# EAGLE design frankfurt_eth_pic (EAGLE 6.6.0)

## Sheet 1 of 3
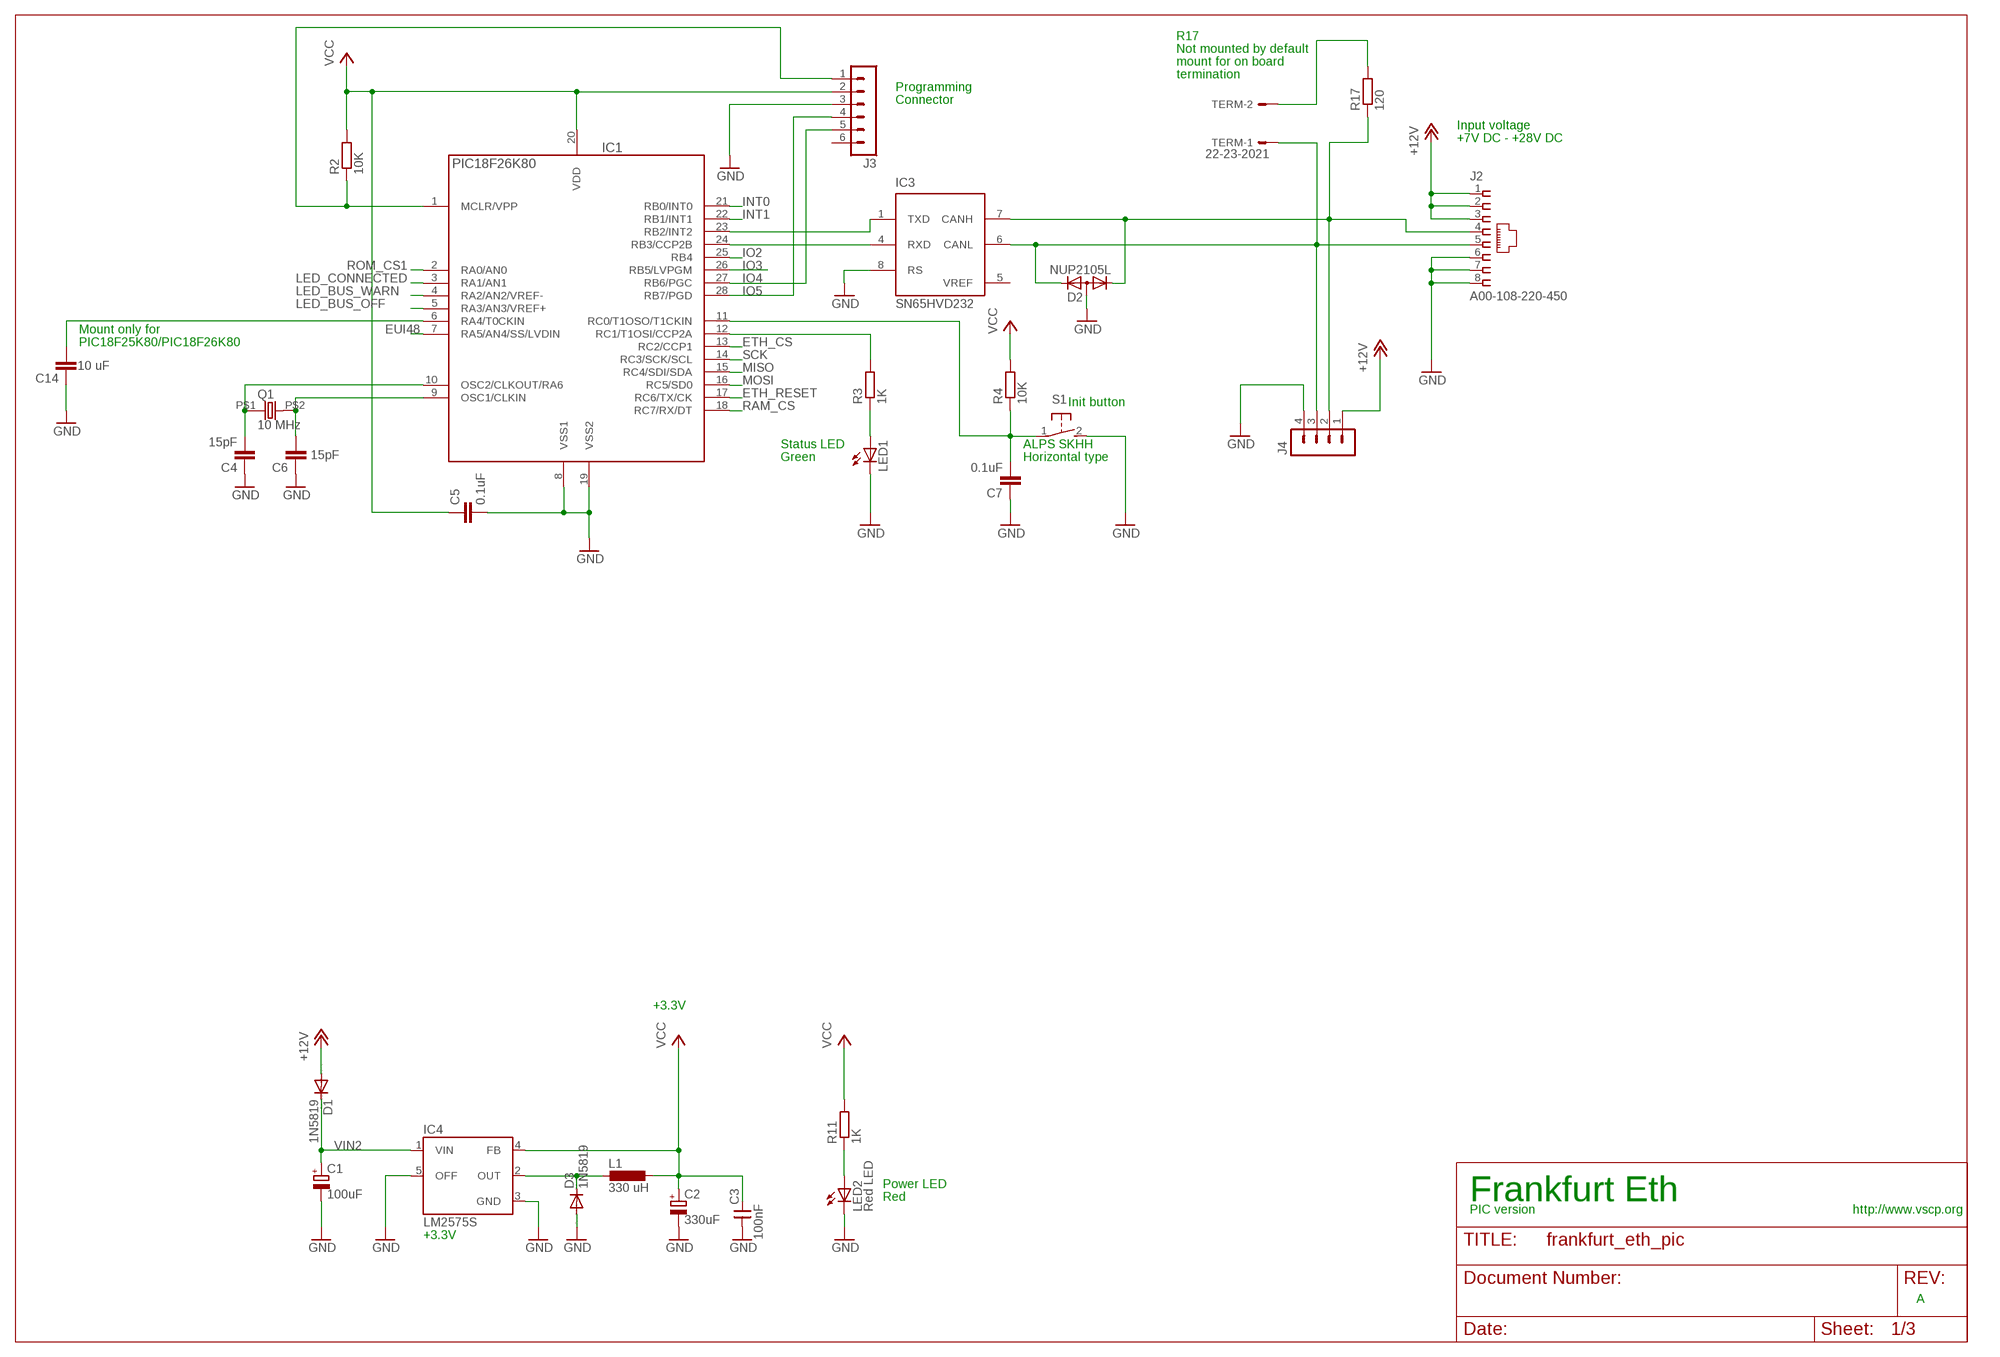
[diagram p0: schematic, sheet 1]

### Parts
C1  100uF  CPOL-EUD  [PANASONIC_D]
C2  330uF  CPOL-EUD  [PANASONIC_D]
C3  100nF  CNP-0805  [0805]
C4  15pF  C-EUC0805  [C0805]
C5  0.1uF  C-EUC0805  [C0805]
C6  15pF  C-EUC0805  [C0805]
C7  0.1uF  C-EUC0805  [C0805]
C14  10 uF  C-EUC0805  [C0805]
D1  1N5819  DIODE-SOD123  [SOD123]
D2  NUP2105L  DIODE-2CA|ACSOT23  [SOT23]
D3  1N5819  DIODE-SOD123  [SOD123]
IC1  PIC18F26K80  PIC18LF252-I/SO  [SO28]
IC3  SN65HVD232  MCP2551SN  [SO-08]
IC4  LM2575S  [TO263-5]
J2  A00-108-220-450  [RJ-45]
J3  MA06-1  [MA06-1]
J4  MA04-1  [MA04-1]
L1  330 uH  DO3316P  [DO3316P]
LED1  LEDCHIP-LED0805  [CHIP-LED0805]
LED2  Red LED  LEDCHIP-LED0805  [CHIP-LED0805]
Q1  10 MHz  HC-49S  [9C]
R2  10K  R-EU_R0805  [R0805]
R3  1K  R-EU_R0805  [R0805]
R4  10K  R-EU_R0805  [R0805]
R11  1K  R-EU_R0805  [R0805]
R17  120  R-EU_R0805  [R0805]
S1  31-XX  [B3F-31XX]
TERM  22-23-2021  [22-23-2021]

### Nets
+12V: D1.A J2.1 J2.2 J2.3 J4.1
CANL: D2.2(K2) IC3.6(CANL) J2.5 J4.3 TERM.1
ETH_CS: IC1.13(RC2/CCP1) ; also sheet 2
ETH_RESET: IC1.17(RC6/TX/CK) ; also sheet 2
EUI48: IC1.7(RA5/AN4/SS/LVDIN) ; also sheet 3
GND: C1.- C2.- C3.1 C4.1 C5.2 C6.1 C7.1 C14.1 D2.3(A) D3.A IC1.8(VSS1) IC1.19(VSS2) IC3.8(RS) IC4.3(GND) IC4.5(OFF) J2.6 J2.7 J2.8 J3.3 J4.4 LED1.C LED2.C S1.2(S) ; also sheet 2,3
INT0: IC1.21(RB0/INT0) ; also sheet 2
INT1: IC1.22(RB1/INT1) ; also sheet 2
IO2: IC1.25(RB4)
IO3: IC1.26(RB5/LVPGM)
IO4: IC1.27(RB6/PGC) J3.5
IO5: IC1.28(RB7/PGD) J3.4
LED_BUS_OFF: IC1.5(RA3/AN3/VREF+) ; also sheet 3
LED_BUS_WARN: IC1.4(RA2/AN2/VREF-) ; also sheet 3
LED_CONNECTED: IC1.3(RA1/AN1) ; also sheet 3
MISO: IC1.15(RC4/SDI/SDA) ; also sheet 2,3
MOSI: IC1.16(RC5/SD0) ; also sheet 2,3
N$1: D3.C IC4.2(OUT) L1.1
N$2: C4.2 IC1.10(OSC2/CLKOUT/RA6) Q1.P$1
N$3: C14.2 IC1.6(RA4/T0CKIN)
N$4: IC1.12(RC1/T1OSI/CCP2A) R3.2
N$5: LED1.A R3.1
N$6: C7.2 IC1.11(RC0/T1OSO/T1CKIN) R4.1 S1.1(P)
N$7: C6.2 IC1.9(OSC1/CLKIN) Q1.P$2
N$11: R17.2 TERM.2
N$20: LED2.A R11.1
N$22: D2.1(K1) IC3.7(CANH) J2.4 J4.2 R17.1
RAM_CS: IC1.18(RC7/RX/DT) ; also sheet 3
RESET: IC1.1(MCLR/VPP) J3.1 R2.1
ROM_CS1: IC1.2(RA0/AN0) ; also sheet 3
RXCAN: IC1.24(RB3/CCP2B) IC3.4(RXD)
SCK: IC1.14(RC3/SCK/SCL) ; also sheet 2,3
TXCAN: IC1.23(RB2/INT2) IC3.1(TXD)
VCC: C2.+ C3.2 C5.1 IC1.20(VDD) IC4.4(FB) J3.2 L1.2 R2.2 R4.2 R11.2 ; also sheet 2,3
VIN2: C1.+ D1.C IC4.1(VIN)
Unconnected: J3.6

### Notes on the sheet
- R17
- Not mounted by default
- mount for on board
- termination
- Programming
- Connector
- Input voltage
- +7V DC - +28V DC
- Mount only for
- PIC18F25K80/PIC18F26K80
- Init button
- Status LED | ALPS SKHH
- Green | Horizontal type
- +3.3V
- Power LED
- Red | Frankfurt Eth
- PIC version | http://www.vscp.org
- +3.3V
- A

## Sheet 2 of 3
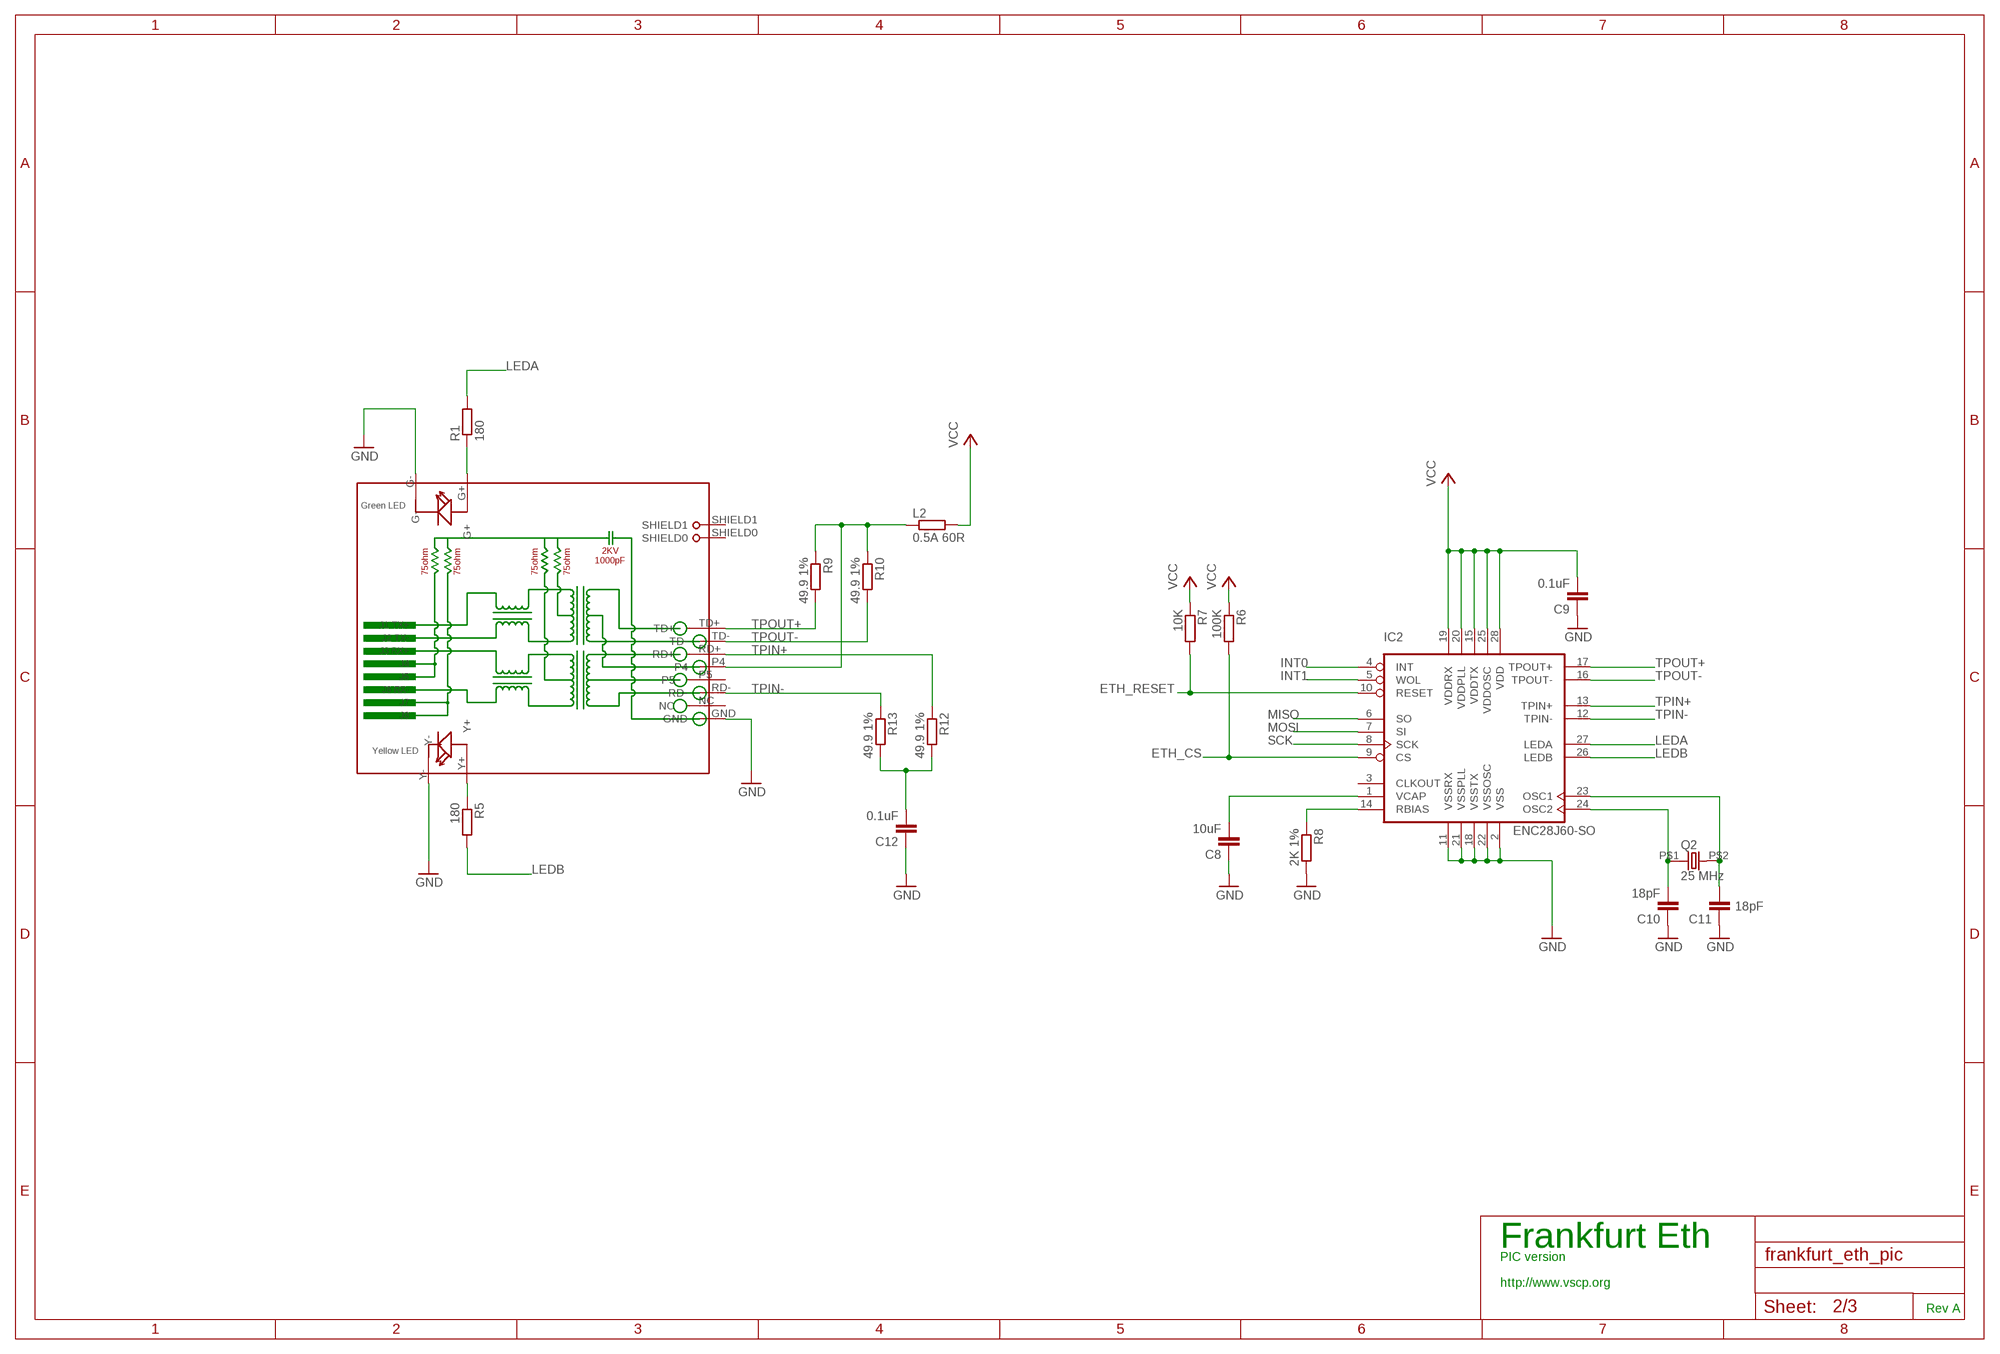
[diagram p1: schematic, sheet 2]

### Parts
C8  10uF  C-EUC0805  [C0805]
C9  0.1uF  C-EUC0805  [C0805]
C10  18pF  C-EUC0805  [C0805]
C11  18pF  C-EUC0805  [C0805]
C12  0.1uF  C-EUC0805  [C0805]
IC2  ENC28J60-SO  [SO28W]
L2  0.5A 60R  R-EU_R0805  [R0805]
Q2  25 MHz  HC-49S  [9C]
R1  180  R-EU_R0805  [R0805]
R5  180  R-EU_R0805  [R0805]
R6  100K  R-EU_R0805  [R0805]
R7  10K  R-EU_R0805  [R0805]
R8  2K 1%  R-EU_R0805  [R0805]
R9  49.9 1%  R-EU_R0805  [R0805]
R10  49.9 1%  R-EU_R0805  [R0805]
R12  49.9 1%  R-EU_R0805  [R0805]
R13  49.9 1%  R-EU_R0805  [R0805]
RJ1  HR911105A  [HR911105A]

### Nets
ETH_CS: IC2.9(CS) R6.2 ; also sheet 1
ETH_RESET: IC2.10(RESET) R7.2 ; also sheet 1
GND: C8.1 C9.1 C10.1 C11.1 C12.1 IC2.2(VSS) IC2.11(VSSRX) IC2.18(VSSTX) IC2.21(VSSPLL) IC2.22(VSSOSC) R8.2 RJ1.G- RJ1.GND RJ1.Y- ; also sheet 1,3
INT0: IC2.4(INT) ; also sheet 1
INT1: IC2.5(WOL) ; also sheet 1
LEDA: IC2.27(LEDA) R1.2
LEDB: IC2.26(LEDB) R5.2
MISO: IC2.6(SO) ; also sheet 1,3
MOSI: IC2.7(SI) ; also sheet 1,3
N$8: R1.1 RJ1.G+
N$9: C8.2 IC2.1(VCAP)
N$10: R5.1 RJ1.Y+
N$13: IC2.14(RBIAS) R8.1
N$15: C10.2 IC2.24(OSC2) Q2.P$1
N$16: C11.2 IC2.23(OSC1) Q2.P$2
N$17: C12.2 R12.2 R13.2
N$19: L2.1 R9.1 R10.1 RJ1.P4
SCK: IC2.8(SCK) ; also sheet 1,3
TPIN+: IC2.13(TPIN+) R12.1 RJ1.RD+
TPIN-: IC2.12(TPIN-) R13.1 RJ1.RD-
TPOUT+: IC2.17(TPOUT+) R9.2 RJ1.TD+
TPOUT-: IC2.16(TPOUT-) R10.2 RJ1.TD-
VCC: C9.2 IC2.15(VDDTX) IC2.19(VDDRX) IC2.20(VDDPLL) IC2.25(VDDOSC) IC2.28(VDD) L2.2 R6.1 R7.1 ; also sheet 1,3
Unconnected: IC2.3(CLKOUT) RJ1.NC RJ1.P5 RJ1.SHIELD0 RJ1.SHIELD1

### Notes on the sheet
- Frankfurt Eth
- PIC version
- http://www.vscp.org
- Rev A

## Sheet 3 of 3
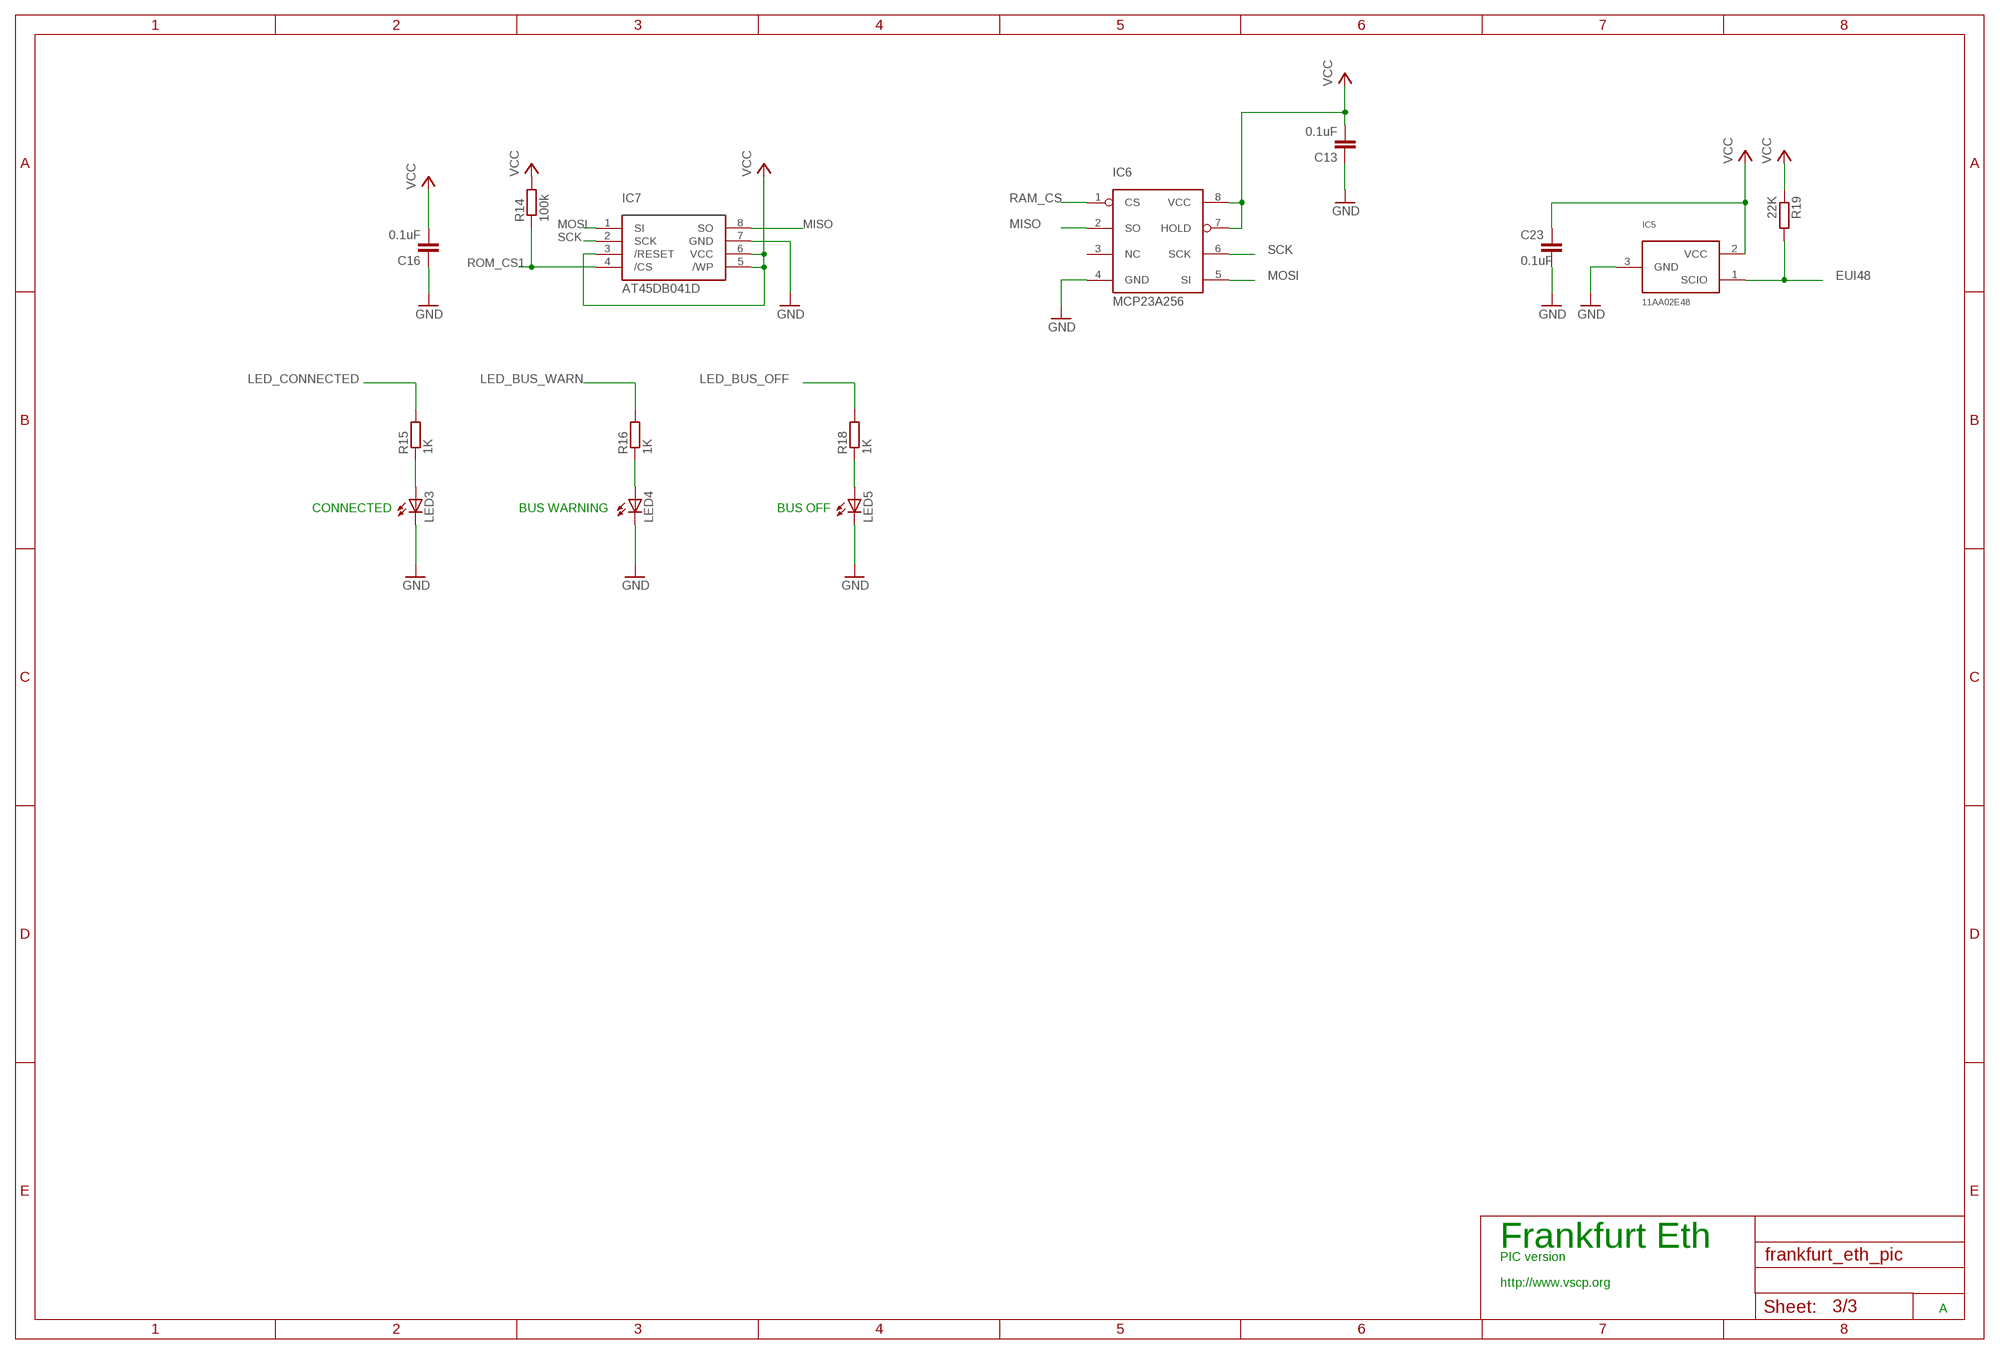
[diagram p2: schematic, sheet 3]

### Parts
C13  0.1uF  C-EUC0805  [C0805]
C16  0.1uF  C-EUC0805  [C0805]
C23  0.1uF  C-EUC0805  [C0805]
IC5  11AA02E48  [SOT23]
IC6  MCP23A256  [SO-8]
IC7  AT45DB041D  AT45DB011DSOP8W  [SOP8W]
LED3  LEDCHIP-LED0805  [CHIP-LED0805]
LED4  LEDCHIP-LED0805  [CHIP-LED0805]
LED5  LEDCHIP-LED0805  [CHIP-LED0805]
R14  100k  R-EU_M0805  [M0805]
R15  1K  R-EU_R0805  [R0805]
R16  1K  R-EU_R0805  [R0805]
R18  1K  R-EU_R0805  [R0805]
R19  22K  R-EU_M0805  [M0805]

### Nets
EUI48: IC5.1(SCIO) R19.2 ; also sheet 1
GND: C13.1 C16.1 C23.2 IC5.3(GND) IC6.4(GND) IC7.7(GND) LED3.C LED4.C LED5.C ; also sheet 1,2
LED_BUS_OFF: R18.2 ; also sheet 1
LED_BUS_WARN: R16.2 ; also sheet 1
LED_CONNECTED: R15.2 ; also sheet 1
MISO: IC6.2(SO) IC7.8(SO) ; also sheet 1,2
MOSI: IC6.5(SI) IC7.1(SI) ; also sheet 1,2
N$14: LED3.A R15.1
N$21: LED4.A R16.1
N$24: LED5.A R18.1
RAM_CS: IC6.1(CS) ; also sheet 1
ROM_CS1: IC7.4(/CS) R14.1 ; also sheet 1
SCK: IC6.6(SCK) IC7.2(SCK) ; also sheet 1,2
VCC: C13.2 C16.2 C23.1 IC5.2(VCC) IC6.7(HOLD) IC6.8(VCC) IC7.3(/RESET) IC7.5(/WP) IC7.6(VCC) R14.2 R19.1 ; also sheet 1,2
Unconnected: IC6.3(NC)

### Notes on the sheet
- CONNECTED | BUS WARNING | BUS OFF
- Frankfurt Eth
- PIC version
- http://www.vscp.org
- A

## Power pins joined to a net without a drawn wire
GND: IC3.2(VSS)
VCC: IC3.3(VDD)
VREF: IC3.5(VREF)

## Library data of the parts
C1 C2 = rcl:CPOL-EU: POLARIZED CAPACITOR, European symbol
C3 = cap-master:CNP-: NON-POLARIZED CAP
C4-C14 C16 C23 = rcl:C-EU: CAPACITOR, European symbol
D1 D3 = diode:DIODE-: DIODE
D2 = diode:DIODE-2CA|AC: Dual DIODE Cathode-Anode|Anode-Cathode
IC1 = pic_olin:PIC18*F252-?: 18F252, 28 pin, 32Kb prog, 1536 data, 256 EEPROM
IC2 = microchip_enet:ENC28J60-*: Microchip 10Mbit Eth. contoller with SPI interface
IC3 = microchip_can:MCP2551: High Speed CAN tranceiver
IC4 = v-reg-3:LM2575: National Semiconductor <http://www.national.com> 1.0A "Simple Switcher"(c) 52kHz, Vout 1.23-37V (HV: 57V), Vin 40V (HV: 60V), 50µA standby current
IC5 = snow:11AA02E48
IC6 = vscpcan:MCP23A256
IC7 = snow:AT45DB011D
J2 = vscpcan:A00-108-220-450
J3 = con-lstb:MA06-1: PIN HEADER; OC_FARNELL: unknown; OC_NEWARK: unknown
J4 = con-lstb:MA04-1: PIN HEADER; OC_FARNELL: unknown; OC_NEWARK: unknown
L1 = inductor-coilcraft:DO3316P: COILCRAFT; OC_FARNELL: unknown; OC_NEWARK: unknown
L2 R1-R19 = rcl:R-EU_: RESISTOR, European symbol
LED1-LED5 = led:LED: LED OSRAM: - CHIPLED LG R971, LG N971, LY N971, LG Q971, LY Q971, LO R971, LY R971 LH N974, LH R974 LS Q976, LO Q976, LY Q976 LO Q996 - Hyper CHIPLED LW Q18S LB Q993, LB Q99A, LB R99A - SideLED LS A670, LO A670, LY A670, LG A670, LP A670 LB A673, LV A673, LT A673, LW A673 LH A674 LY A675 LS A676, LA A676, LO A676, LY A676, LW A676 LS A679, LY A679, LG A679 - Hyper Micro SIDELED® LS Y876, LA Y876, LO Y876, LY Y876 LT Y87S - SmartLED LW L88C, LW L88S LB L89C, LB L89S, LG L890 LS L89K, LO L89K, LY L89K LS L896, LA L896, LO L896, LY L896 - TOPLED LS T670, LO T670, LY T670, LG T670, LP T670 LSG T670, LSP T670, LSY T670, LOP T670, LYG T670 LG T671, LOG T671, LSG T671 LB T673, LV T673, LT T673, LW T673 LH T674 LS T676, LA T676, LO T676, LY T676, LB T676, LH T676, LSB T676, LW T676 LB T67C, LV T67C, LT T67C, LS T67K, LO T67K, LY T67K, LW E67C LS E67B, LA E67B, LO E67B, LY E67B, LB E67C, LV E67C, LT E67C LW T67C LS T679, LY T679, LG T679 LS T770, LO T770, LY T770, LG T770, LP T770 LB T773, LV T773, LT T773, LW T773 LH T774 LS E675, LA E675, LY E675, LS T675 LS T776, LA T776, LO T776, LY T776, LB T776 LHGB T686 LT T68C, LB T68C - Hyper Mini TOPLED® LB M676 - Mini TOPLED Santana® LG M470 LS M47K, LO M47K, LY M47K Source: http://www.osram.convergy.de LUXEON: - LUMILED® LXK2-PW12-R00, LXK2-PW12-S00, LXK2-PW14-U00, LXK2-PW14-V00 LXK2-PM12-R00, LXK2-PM12-S00, LXK2-PM14-U00 LXK2-PE12-Q00, LXK2-PE12-R00, LXK2-PE12-S00, LXK2-PE14-T00, LXK2-PE14-U00 LXK2-PB12-K00, LXK2-PB12-L00, LXK2-PB12-M00, LXK2-PB14-N00, LXK2-PB14-P00, LXK2-PB14-Q00 LXK2-PR12-L00, LXK2-PR12-M00, LXK2-PR14-Q00, LXK2-PR14-R00 LXK2-PD12-Q00, LXK2-PD12-R00, LXK2-PD12-S00 LXK2-PH12-R00, LXK2-PH12-S00 LXK2-PL12-P00, LXK2-PL12-Q00, LXK2-PL12-R00 Source: www.luxeon.com KINGBRIGHT: KA-3528ASYC Source: www.kingbright.com
Q1 Q2 = vscpcan:HC-49S: Digikey 887-1050-1-nd
RJ1 = hr911105a:HR911105A
S1 = switch-omron:31-XX: OMRON SWITCH; MPN: B3F-3100; OC_FARNELL: 959704; OC_NEWARK: 36M3582
TERM = con-molex:22-23-2021: .100" (2.54mm) Center Header - 2 Pin; MF: MOLEX; MPN: 22-23-2021; OC_FARNELL: 1462926; OC_NEWARK: 25C3832

## Board
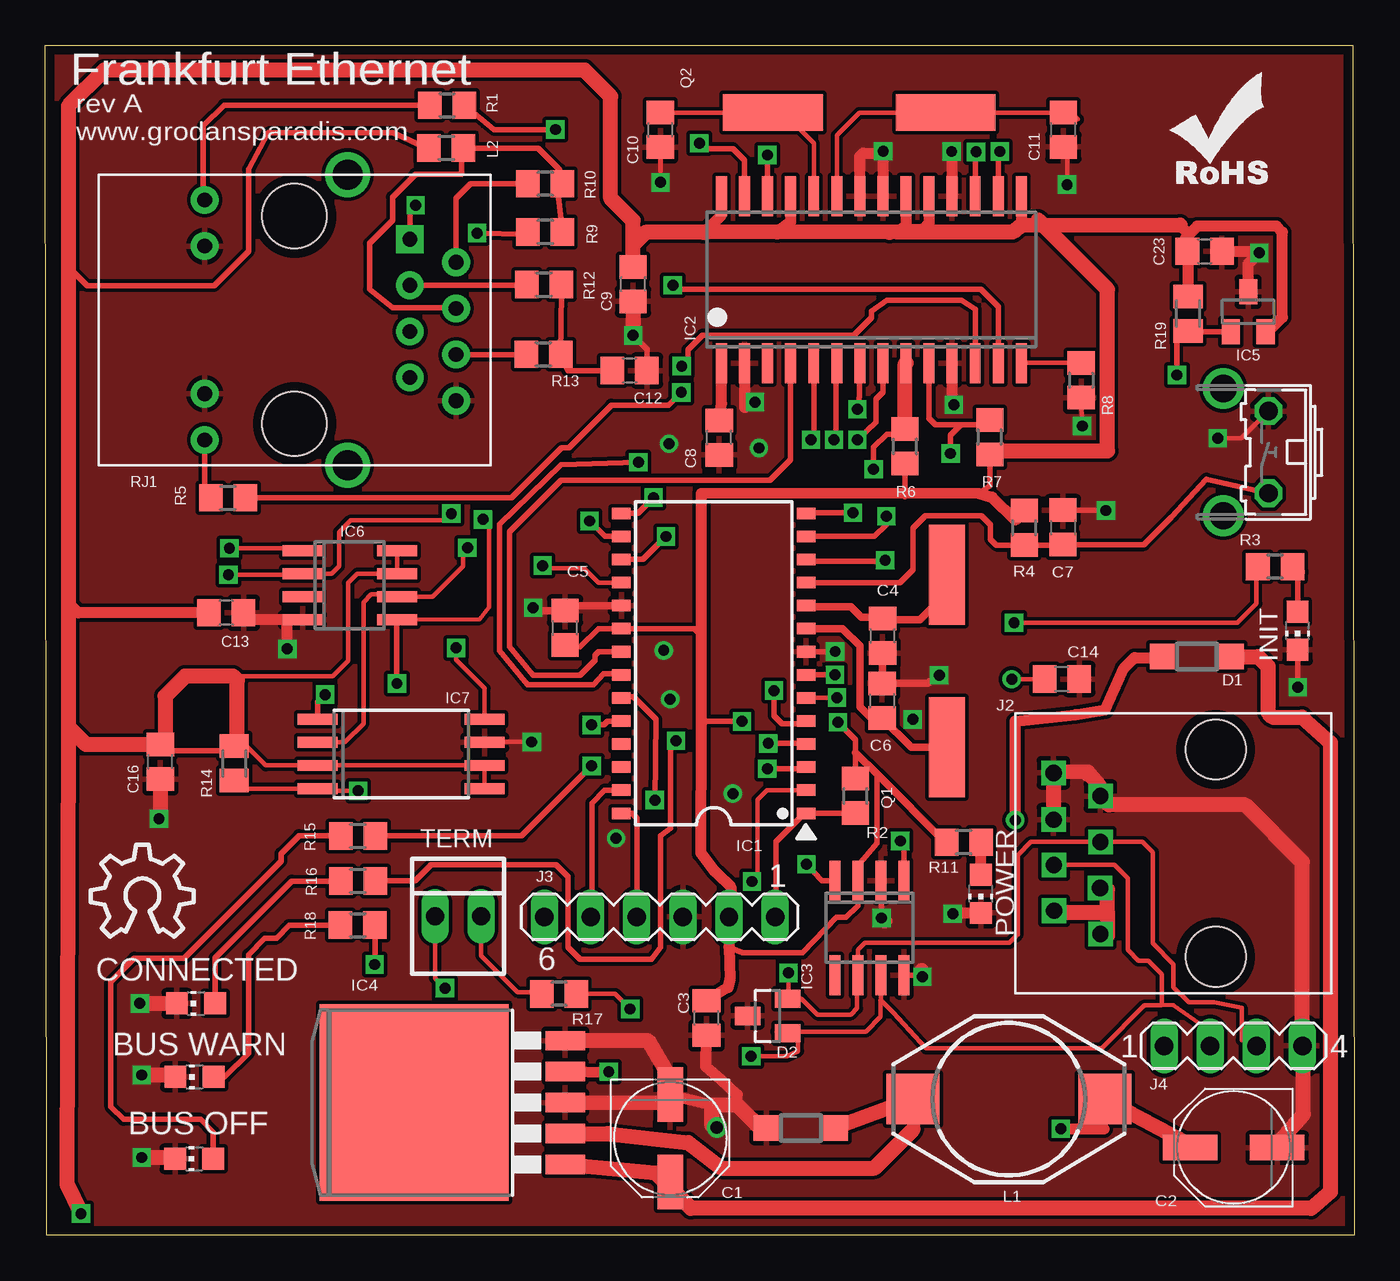
[diagram p3: board, top side]
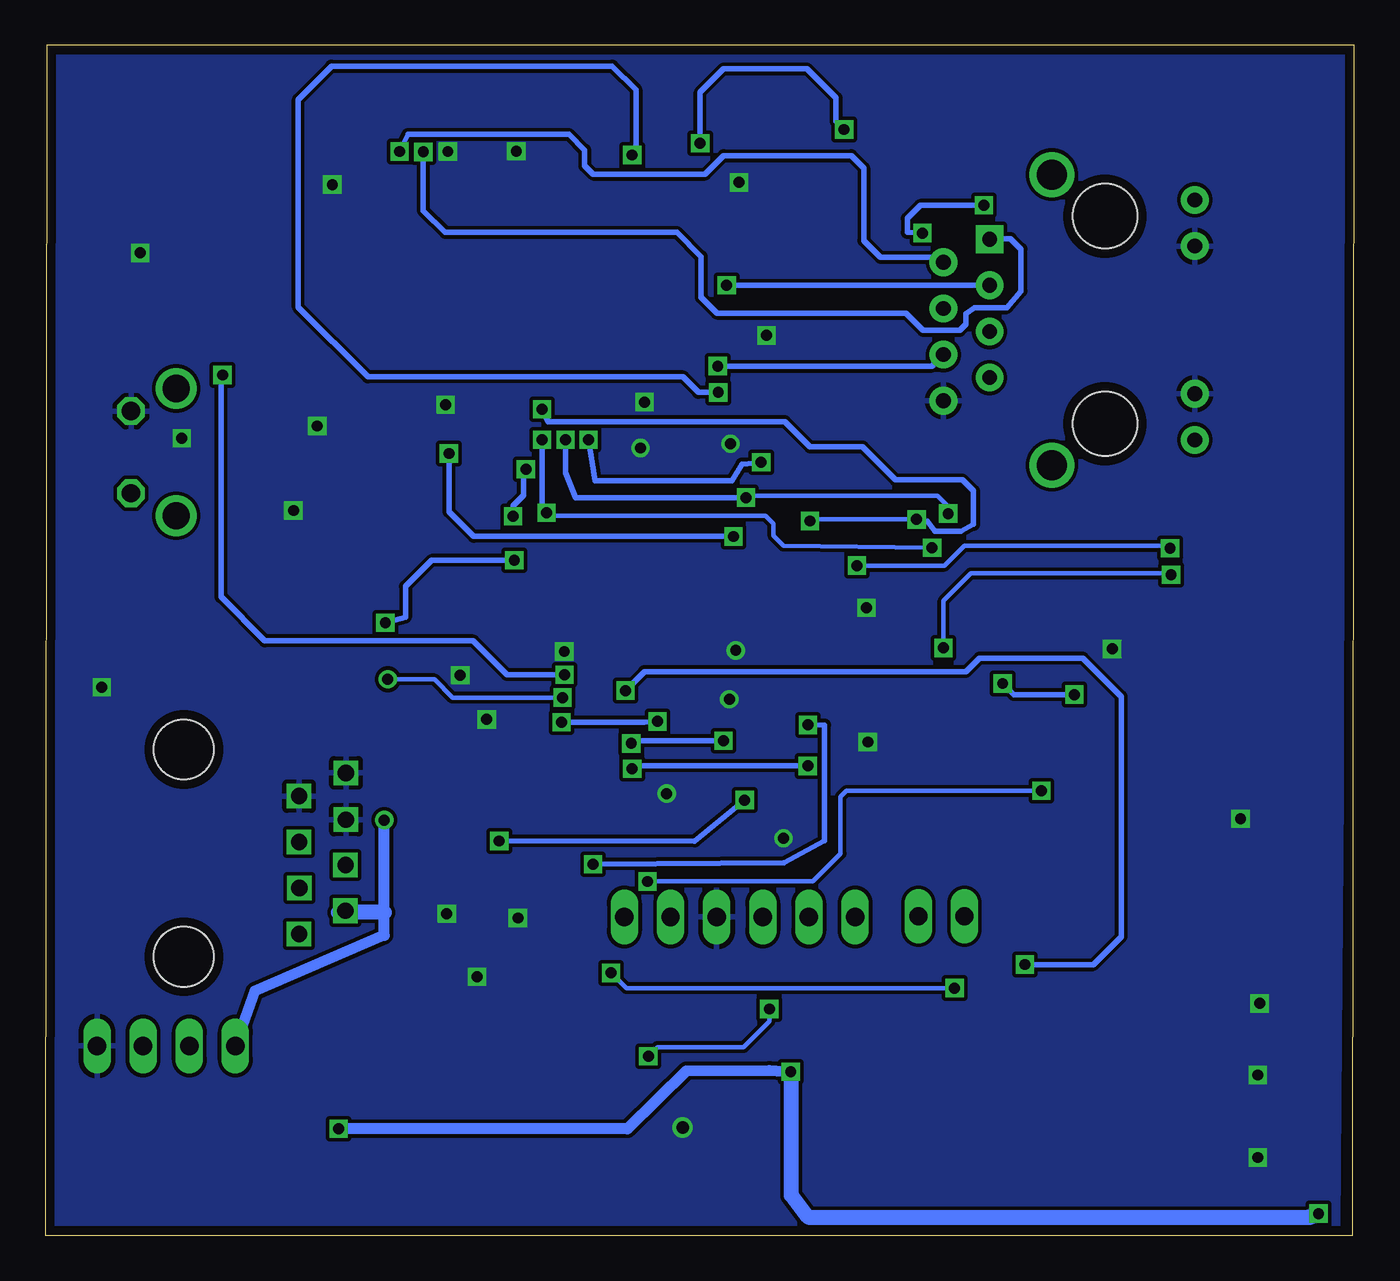
[diagram p4: board, bottom side, seen from below]

Size 72.06 x 65.5 mm. Coordinates in mm from the lower left corner, seen from the top.
Outline: 0.06,0 0,65.5 72,65.5 72.06,0 0.06,0
Copper layers (1*16): Top 0.035mm / dielectric 1.5mm / Bottom 0.035mm
Design rules "8mils": minimum track width 8mil, minimum drill 0.6mm, track to track 8mil, track to pad 8mil, pad to pad 8mil, via to via 8mil, smd to smd 0mil, copper to edge 20mil, drill to drill 10mil, minimum pad ring 8mil, minimum via ring 8mil, stop-mask expansion 0mil, vias tented up to drill 0mil, thermal gap 10mil

### Footprints (pad centres in the part's own frame; a part is rotated, then mirrored left to right if it is on the bottom)
PANASONIC_D = smd 3 x 1.4: + 2.4,0; - -2.4,0
0805 = smd 1.27 x 1.524: 1 -0.953,0; 2 0.953,0
C0805 = smd 1.3 x 1.5: 1 -0.95,0; 2 0.95,0
SOD123 = smd 1.4 x 1.4: A 1.9,0; C -1.9,0
SOT23 = smd 1 x 1.4: 1 -0.95,-1.1; 2 0.95,-1.1; 3 0,1.1
SO28 = smd 0.635 x 1.016: 1 -8.255,-5.08; 2 -6.985,-5.08; 3 -5.715,-5.08; 4 -4.445,-5.08; 5 -3.175,-5.08; 6 -1.905,-5.08; 7 -0.635,-5.08; 8 0.635,-5.08; 9 1.905,-5.08; 10 3.175,-5.08; 11 4.445,-5.08; 12 5.715,-5.08; 13 6.985,-5.08; 14 8.255,-5.08; 15 8.255,5.08; 16 6.985,5.08; 17 5.715,5.08; 18 4.445,5.08; 19 3.175,5.08; 20 1.905,5.08; 21 0.635,5.08; 22 -0.635,5.08; 23 -1.905,5.08; 24 -3.175,5.08; 25 -4.445,5.08; 26 -5.715,5.08; 27 -6.985,5.08; 28 -8.255,5.08
SO28W = smd 0.6 x 2.2: 1 -8.255,-4.6; 2 -6.985,-4.6; 3 -5.715,-4.6; 4 -4.445,-4.6; 5 -3.175,-4.6; 6 -1.905,-4.6; 7 -0.635,-4.6; 8 0.635,-4.6; 9 1.905,-4.6; 10 3.175,-4.6; 11 4.445,-4.6; 12 5.715,-4.6; 13 6.985,-4.6; 14 8.255,-4.6; 15 8.255,4.6; 16 6.985,4.6; 17 5.715,4.6; 18 4.445,4.6; 19 3.175,4.6; 20 1.905,4.6; 21 0.635,4.6; 22 -0.635,4.6; 23 -1.905,4.6; 24 -3.175,4.6; 25 -4.445,4.6; 26 -5.715,4.6; 27 -6.985,4.6; 28 -8.255,4.6
SO-08 = smd 0.6 x 2.2: 1 -1.905,-2.6; 2 -0.635,-2.6; 3 0.635,-2.6; 4 1.905,-2.6; 5 1.905,2.6; 6 0.635,2.6; 7 -0.635,2.6; 8 -1.905,2.6
TO263-5 = smd 1.067 x 2.159: 1 -3.404,-5.791; 2 -1.702,-5.791; 3 0,-5.791; 4 1.702,-5.791; 5 3.404,-5.791 | smd 10.8 x 10.41: 6 0,2.54
SO-8 = smd 0.6 x 2.2: 1 -1.905,-2.6; 2 -0.635,-2.6; 3 0.635,-2.6; 4 1.905,-2.6; 5 1.905,2.6; 6 0.635,2.6; 7 -0.635,2.6; 8 -1.905,2.6
SOP8W = smd 2.2 x 0.6: 1 -4.6,1.905; 2 -4.6,0.635; 3 -4.6,-0.635; 4 -4.6,-1.905; 5 4.6,-1.905; 6 4.6,-0.635; 7 4.6,0.635; 8 4.6,1.905
RJ-45 = drill 0.9 square: 1 -4.45,6.35; 2 -3.17,8.89; 3 -1.92,6.36; 4 -0.65,8.91; 5 0.62,6.35; 6 1.84,8.93; 7 3.14,6.35; 8 4.42,8.93 | hole 3.3: -5.7,0; 5.7,0
MA06-1 = drill 1.016 long: 1 -6.35,0; 2 -3.81,0; 3 -1.27,0; 4 1.27,0; 5 3.81,0; 6 6.35,0
MA04-1 = drill 1.016 long: 1 -3.81,0; 2 -1.27,0; 3 1.27,0; 4 3.81,0
DO3316P = smd 2.92 x 2.79: 1 -5.28,0; 2 5.28,0
R0805 = smd 1.3 x 1.5: 1 -0.95,0; 2 0.95,0
CHIP-LED0805 = smd 1.2 x 1.2: A 0,-1.05; C 0,1.05
9C = smd 5.5 x 2: P$1 -4.74,0; P$2 4.76,0
M0805 = smd 1.3 x 1.6: 1 -0.95,0; 2 0.95,0
HR911105A = drill 0.813 pad 1.524: G+ 4.953,-6.604; G- 4.953,-4.064; GND -8.89,4.445; NC -6.35,3.175; P4 -8.89,-0.635; P5 -6.35,0.635; RD+ -6.35,-1.905; RD- -8.89,1.905; TD- -8.89,-3.175; Y+ 4.953,6.604; Y- 4.953,4.064 | drill 1.651 pad 2.159: SHIELD0 -2.921,8.001; SHIELD1 -2.921,-8.001 | drill 0.813 pad 1.524 square: TD+ -6.35,-4.445 | hole 3.556: 0,-5.715; 0,5.715
B3F-31XX = drill 1.016 octagon: 1 -2.261,-1.245; 2 2.261,-1.245 | drill 1.499 pad 2.159: 3 -3.505,1.245; 4 3.505,1.245
22-23-2021 = drill 1 long: 1 -1.27,0; 2 1.27,0

### Placement (x,y rotation side)
C1  34.4,5.34 270 top
C2  65.42,4.84 180 top
C3  36.4,11.96 90 top
C4  46.1,33 90 top
C5  28.61,33.44 90 top
C6  46.07,29.43 270 top
C7  56.03,38.97 270 top
C8  37.1,43.91 90 top
C9  32.36,52.36 90 top
C10  33.86,60.85 90 top
C11  56.05,60.86 90 top
C12  32.17,47.6 180 top
C13  9.96,34.27 180 top
C14  55.97,30.62 180 top
C16  6.33,26.07 90 top
C23  63.83,54.17 0 top
D1  63.4,31.86 180 top
D2  39.77,12.08 90 top
D3  41.59,5.91 180 top
IC1  36.8,31.49 90 top
IC2  45.48,52.61 0 top
IC3  45.37,16.93 180 top
IC4  22.83,7.31 90 top
IC5  66.23,50.84 0 top
IC6  16.76,35.79 270 top
IC7  19.59,26.5 0 top
J2  64.44,21.04 90 top
J3  33.83,17.53 180 top
J4  65.41,10.43 0 top
L1  53.05,7.5 0 top
L2  22.07,59.85 180 top
LED1  68.95,33.28 180 top
LED2  51.51,18.8 180 top
LED3  8.19,4.22 90 top
LED4  8.29,12.77 90 top
LED5  8.21,8.73 90 top
Q1  49.64,31.63 270 top
Q2  44.81,61.8 0 top
R1  22.12,62.21 0 top
R2  44.6,24.19 90 top
R3  67.71,36.81 180 top
R4  53.9,38.95 90 top
R5  10.06,40.6 0 top
R6  47.33,43.43 90 top
R7  52,43.94 90 top
R8  57.03,47.07 270 top
R9  27.52,55.23 180 top
R10  27.52,57.88 180 top
R11  50.57,21.64 180 top
R12  27.45,52.34 0 top
R13  27.42,48.5 0 top
R14  10.4,25.98 90 top
R15  17.21,21.99 0 top
R16  17.21,19.51 0 top
R17  28.28,13.29 180 top
R18  17.2,17.08 0 top
R19  62.92,50.74 270 top
RJ1  13.72,50.39 180 top
S1  66.1,43.11 90 top
TERM  22.72,17.57 0 top
U$1  [ROHS_SILK]  64.03,60.28 0 top
U$2  [OSHW_10X200_NOTEXT]  2.5,16.43 0 top

### Tracks (layer width: path | path; a pad name or v marks a point on that pad's centre or on a via)
+12V  (via drill 0.6)
  Top 0.203: J2.2 55.94,17.78 | 58.48,16.51 J2.1
  Top 0.305: 61.44,31.8 D1.A
  Top 0.61: v53.4,22.86 53.4,28.31 56.72,28.67 58.36,28.93 59.39,31.22 59.97,31.8 61.44,31.8
  Top 0.813: 55.94,17.78 58.48,17.78 | 58.48,17.78 58.48,19.05 J2.3 | 58.48,17.78 58.48,16.51
  Bottom 0.203: 55.94,17.78 J2.2
  Bottom 0.61: v53.4,22.86 53.4,17.78 53.4,16.51 60.53,13.44 J4.1
  Bottom 0.813: 53.4,17.78 55.94,17.78
CANL  (via drill 0.6)
  Top 0.203: 53.45,16.46 53.4,16.51
  Top 0.254: J4.3 65.87,10.75 65.87,12.53 64.35,12.83 62.96,12.83 62.12,13.67 62.12,14.93 60.98,16.07 60.98,21.09 60.41,21.66 J2.5 54.27,21.66 53.54,20.93 53.54,16.56 53.45,16.46 53.08,16.1 45.12,16.1 44.73,15.71 IC3.6 44.69,14.29 44.69,12.49 44.35,12.15 42.52,12.15 41.64,13.03 D2.2 40.91,13.07 v40.91,14.45 | TERM.1 21.45,14.16 v22,13.61
  Bottom 0.254: v22,13.61 40.07,13.61 v40.91,14.45
ETH_CS  (via drill 0.6)
  Top 0.305: IC1.13 45.66,38.48 46.31,39.13 v46.31,39.58 | v45.6,42.17 45.6,43.38 46.33,44.11 47.06,44.11 R6.2
  Top 0.813: R6.2 47.33,47.95 IC2.9
  Bottom 0.305: v46.31,39.58 46.31,40.17 45.74,40.74 45.74,42.03 v45.6,42.17
ETH_RESET  (via drill 0.6)
  Top 0.305: IC2.10 48.66,44.97 49,44.62 50.42,44.62 | 50.42,44.62 51.73,44.62 R7.2 | IC1.17 32.91,37.2 v34.17,38.47 | v49.84,43.04 49.84,44.04 50.42,44.62
  Bottom 0.305: v34.17,38.47 48.47,38.47 49.84,39.84 v49.84,43.04
EUI48  (via drill 0.6)
  Top 0.305: IC5.1 62.97,49.74 R19.2 62.31,49.18 v62.31,47.36 | IC1.7 v43.48,30.86
  Bottom 0.305: v43.48,30.86 46.64,30.86 48.51,32.73 59.98,32.73 62.39,35.14 62.39,47.28 v62.31,47.36
GND  (via drill 0.6, 0.7)
  Top 0.254: 36.69,7.18 36.69,7.36 | v64.56,43.88 65.85,43.88 S1.2 | v33.87,57.96 C10.1 | v56.26,57.84 56.26,59.7 C11.1 | R8.2 57.06,44.56 v57.09,44.55 | v26.78,27.16 24.21,27.16 IC7.7
  Top 0.305: IC3.8 48.2,14.33 v48.29,14.24 | v46.04,17.47 46.04,19.5 IC3.2 | LED1.C v68.96,30.17 | C7.1 58.38,39.92 v58.4,39.9 | IC1.8 43.33,32.12 v43.49,32.14 | C12.1 33.12,48.77 v32.35,49.54
  Top 0.406: IC1.19 28.88,34.66 C5.2 27.25,34.39 v26.85,34.55 | C4.1 46.1,30.41 C6.1 48.57,30.38 v49.22,30.83
  Top 0.61: 34.11,7.32 34.39,6.65 34.68,7.21 34.71,7.18 | 34.71,7.18 34.76,7.13 | 34.71,7.18 C1.- | 39.48,5.79 39.39,5.88 D3.A 39.54,5.91 | C1.- 36.69,7.18 | 39.54,5.91 39.64,5.81 | 39.54,5.91 38.99,6.46 | 34.5,7.15 34.4,7.05 | C1.- 34.5,7.15 | 34.53,8.45 34.53,7.18 34.5,7.15 | 36.69,6.09 v36.97,5.94 | 38.09,7.18 38.09,7.75 37.2,8.56 36.37,9.29 C3.1 | 50.01,17.75 LED2.C | IC2.2 38.5,45.58 v39.07,45.87 | IC2.11 49.93,45.81 v50.02,45.72 | v49.9,59.66 49.92,59.3 49.94,57.25 | 49.93,57.24 IC2.18 | IC2.21 46.13,57.23 v46.13,59.67 46.03,59.57 45.02,59.57 44.84,59.4 IC2.22 | C23.2 66.75,54.17 v66.84,54.08 66.23,53.47 IC5.3 | IC6.4 13.12,33.88 | 13.12,33.88 11.29,33.88 C13.1 | v13.32,32.28 13.32,33.69 13.12,33.88
  Top 0.813: IC4.3 34.11,7.32 | 39.39,5.88 38.09,7.18 36.69,7.18 36.69,6.09 | IC4.5 33.2,10.71 34.53,8.45 | C2.- 67.82,5.06 69.27,6.67 69.27,10.16 J4.4 69.22,20.54 66.06,23.7 58.57,23.7 J2.7 58.04,24.74 57.47,25.39 57.41,25.51 | 57.36,25.4 57.41,25.51 | 57.41,25.51 55.55,25.5 J2.8 J2.6 | 46.21,17.3 v46.04,17.47 | 48.26,14.57 v48.29,14.24 | C9.1 v32.36,49.55 v32.35,49.54 | C16.1 6.33,23.01 v6.25,22.93 | v5.2,12.77 LED4.C | v5.3,8.83 7.06,8.83 LED5.C | v5.3,4.29 7.07,4.29 LED3.C
  Bottom 0.305: J4.4 69.32,10.33
  other vias: 49.96,17.7 47.76,28.4 31.42,21.86 34.4,29.51 34.05,32.2 37.85,24.32 34.34,43.58 39.29,43.34
  pour Top: 0.42,64.93 0.34,64.75 0.67,0.36 71.64,0.36 71.64,0.49 71.52,0.49 71.52,65.17 0.67,65.17 0.45,65.16
  pour Bottom: 0.42,65.17 0.37,65.17 0.91,0.49 71.64,0.49 71.64,65.17 1.43,65.19 1.25,65.18
INT0
  Top 0.305: IC2.4 41.04,42.7 39.9,41.57 28.4,41.57 25.57,38.74 25.57,32.4 26.85,30.84 29.44,30.84 30.27,31.67 30.27,31.94 30.45,32.12 IC1.21
INT1  (via drill 0.6)
  Top 0.305: IC2.5 42.3,43.88 v42.15,43.79 | v32.65,42.56 28.38,42.41 25.02,39.15 25.02,32.19 26.54,30.32 30.17,30.32 30.72,30.91 31.66,30.91 IC1.22
  Bottom 0.305: v42.15,43.79 41.8,41.53 34.26,41.54 33.71,42.45 32.73,42.53 v32.65,42.56
IO4
  Top 0.305: IC1.27 30.79,24.5 30.09,23.8 30.09,17.6 J3.5
IO5
  Top 0.305: IC1.28 32.3,23.23 32.58,22.96 32.58,17.55 J3.4
LED_BUS_OFF  (via drill 0.6)
  Top 0.305: R18.2 18.15,14.93 v18.13,14.91 | v40.12,29.99 40.12,28.61 40.57,28.16 41.73,28.16 IC1.5
  Bottom 0.305: v18.13,14.91 14.36,14.91 12.82,16.45 12.82,29.66 14.94,31.78 20.63,31.78 21.38,31.03 39.08,31.03 v40.12,29.99
LED_BUS_WARN  (via drill 0.6)
  Top 0.305: R16.2 20.36,19.51 21.25,20.4 28.13,20.4 28.78,19.75 28.78,15.86 29.43,15.21 33.37,15.21 33.86,15.86 33.86,22 34.42,22.4 34.42,26.93 v34.72,27.23 | v39.8,27.08 41.84,27.08 IC1.4
  Bottom 0.305: v34.72,27.23 39.65,27.23 v39.8,27.08
LED_CONNECTED  (via drill 0.6)
  Top 0.305: R15.2 26.23,21.99 v30.08,25.84 | v39.75,25.69 41.8,25.69 IC1.3
  Bottom 0.305: v30.08,25.84 39.6,25.84 v39.75,25.69
LEDA  (via drill 0.6)
  Top 0.305: IC2.27 38.5,59.17 37.85,59.82 36.31,59.82 v36.01,60.12 | v28.08,60.87 24.71,60.87 R1.2
  Bottom 0.305: v36.01,60.12 36.01,62.91 34.71,64.21 30.13,64.21 28.53,62.61 28.53,61.32 v28.08,60.87
LEDB  (via drill 0.6)
  Top 0.305: R5.2 25.68,40.6 28.43,43.35 28.82,43.35 31.17,45.7 34.31,45.7 v35.01,46.4 | v39.75,59.47 39.75,57.23 IC2.26
  Bottom 0.305: v35.01,46.4 36.1,46.4 36.95,47.25 54.3,47.25 58.14,51.09 58.14,62.52 56.3,64.36 40.85,64.36 39.55,63.06 39.55,59.67 v39.75,59.47
MISO  (via drill 0.6)
  Top 0.254: v22.35,39.73 22.15,39.36 16.81,39.36 16.16,38.71 16.16,36.82 15.77,36.42 IC6.2 14.1,36.36 v10.08,36.36 | IC7.8 24.19,30.11 22.61,31.69 v22.61,32.34
  Top 0.305: IC1.15 32.62,39.74 v33.49,40.61 | v43.42,43.79 43.54,43.79 43.54,47.97 IC2.6
  Bottom 0.254: v22.35,39.73 22.35,40.12 22.94,40.71 33.39,40.71 v33.49,40.61 | v22.61,32.34 22.61,34.93 21.1,36.44 10.48,36.44 v10.08,36.36
  Bottom 0.305: v33.49,40.61 42.88,40.61 43.41,41.99 v43.42,43.79
MOSI  (via drill 0.6)
  Top 0.254: IC6.5 23.89,33.91 24.44,34.57 24.44,39.06 v24.09,39.41
  Top 0.305: IC1.16 30.8,38.48 v29.96,39.32 | v44.71,45.47 44.78,45.85 44.81,46.21 44.81,47.98 IC2.7 | IC7.1 14.99,29.36 v15.4,29.77 | v19.35,30.38 IC6.5
  Bottom 0.254: v24.09,39.41 29.87,39.41 v29.96,39.32
  Bottom 0.305: v44.71,45.47 44.39,44.79 31.35,44.79 29.96,43.4 27.06,43.4 25.25,41.59 21.57,41.59 20.96,40.98 20.96,39.14 21.65,38.76 23.09,38.76 23.49,39.31 23.99,39.31 v24.09,39.41 | v15.4,29.77 18.74,29.77 v19.35,30.38
N$1
  Top 0.61: 47.89,5.86 47.84,5.91 L1.1 47.77,5.81 | IC4.2 29.21,5.65 29.09,5.59
  Top 0.813: L1.1 D3.C | 47.77,5.81 45.66,3.7 37.22,3.7 35.41,5.11 30.98,5.6 28.67,5.6 29.21,5.65
N$2
  Top 0.406: Q1.P$1 49.64,35.37 48.16,33.89 45.72,33.89 45.58,34.03 | 45.58,34.03 46.02,34.03 C4.2 | 45.58,34.03 44.93,34.03 44.36,34.6 41.95,34.6 IC1.10
N$3  (via drill 0.6)
  Top 0.254: IC1.6 43.58,29.59 v43.58,29.6 | v53.21,30.61 C14.2
  Bottom 0.254: v43.58,29.6 49.64,29.6 50.64,30.6 v53.2,30.6 v53.21,30.61
N$4  (via drill 0.6)
  Top 0.254: v53.34,33.72 65.62,33.72 66.68,34.78 66.68,36.73 R3.2
  Top 0.305: IC1.12 41.98,37.2 42.07,37.12 46.2,37.12 v46.24,37.16
  Bottom 0.305: v46.24,37.16 50.79,37.16 52.23,35.72 52.23,34.03 v53.34,33.72
N$5
  Top 0.305: LED1.A 68.95,36.52
  Top 0.813: 68.95,36.52 R3.1
N$6
  Top 0.305: IC1.11 41.9,35.92 47.05,35.92 47.77,36.64 47.77,38.92 48.45,39.6 51.55,39.6 52.04,39.11 52.04,38.33 52.37,38 R4.1 56.01,38 C7.2 60.49,38.02 62.01,39.54 63.93,41.63 S1.1
N$7
  Top 0.406: Q1.P$2 47.68,26.87 C6.2 45.47,28.48 44.84,29.11 44.84,32.45 43.89,33.4 IC1.9
N$8
  Top 0.305: R1.1 9.83,62.21 8.69,61.07 8.69,57.07 RJ1.G+
N$9
  Top 0.61: C8.2 37.24,45.78 IC2.1
N$10
  Top 0.305: RJ1.Y+ 8.77,40.54 R5.1
N$11
  Top 0.254: TERM.2 23.99,15.4 26,13.39 27.23,13.39 R17.2
N$13
  Top 0.254: IC2.14 53.91,48.01 53.92,48.02 R8.1 | R8.1 57.45,48.02 57.63,47.84 57.21,47.84 R8.1
N$14
  Top 0.305: LED3.A 9.24,5.68 8.54,6.38 4.3,6.38 3.6,7.08 3.6,13.96 4.9,15.26 7.64,15.26 12.98,20.6 12.98,21.01 13.97,22 R15.1
N$15
  Top 0.254: IC2.24 42.3,60.12 40.81,61.61 40.26,61.61 Q2.P$1 C10.2
N$16
  Top 0.254: C11.2 56.43,61.43 56.85,61.43 56.48,61.8 Q2.P$2 44.82,61.79 43.58,60.55 IC2.23
N$17
  Top 0.305: C12.2 28.77,47.6 R13.2 28.42,51.92 R12.2
N$19
  Top 0.305: R9.1 28.17,57.83 R10.1 28.32,57.98 28.32,58.66 27.13,59.85 L2.1 22.92,59.69 22.92,58.42 20.38,58.42 19.11,57.15 19.11,55.88 17.84,54.61 17.84,52.07 19.11,51.06 22.92,51.06 RJ1.P4
N$20
  Top 0.61: R11.1 LED2.A
N$21
  Top 0.305: LED4.A 9.34,15.27 13.57,19.5 R16.1
N$22  (via drill 0.6)
  Top 0.254: 46.01,12.95 IC3.7 | 46.01,12.95 46.67,12.28 48.49,10.3 58.16,10.3 60.52,12.66 61.43,12.66 61.47,12.7 | 61.47,12.7 61.47,14.38 60.72,15.13 60.18,15.13 59.59,15.72 59.59,19.66 58.86,20.39 J2.4 | 61.47,12.7 62.11,12.66 63.84,11.47 J4.2 | 46.01,12.95 45.99,12.93 45.99,12.03 45.18,11.22 40.25,11.22 D2.1 41.44,11.18 41.44,10.14 40.82,9.86 v38.86,9.86 | R17.1 31.37,13.29 v32.2,12.46
  Top 0.305: IC3.7 45.98,14.3
  Bottom 0.254: v32.2,12.46 32.2,11.78 33.62,10.36 38.36,10.36 v38.86,9.86
N$24
  Top 0.305: LED5.A 9.88,8.73 11.18,10.03 11.18,15.46 12.08,16.36 12.72,16.36 13.42,17.06 16.23,17.06 R18.1
RAM_CS  (via drill 0.6)
  Top 0.254: IC1.18 30.45,35.94 29.67,36.72 27.53,36.72 v27.38,36.87 | v10.13,37.82 14.04,37.82 IC6.1
  Bottom 0.254: v27.38,36.87 22.55,36.87 21.45,37.97 10.28,37.97 v10.13,37.82
RESET
  Top 0.305: IC1.1 R2.1 41.8,23.24 40.22,21.66 40.22,17.57 J3.1
ROM_CS1  (via drill 0.6)
  Top 0.254: R14.1 10.84,24.59 IC7.4 15.12,24.47 v17.22,24.47 | IC1.2 39.73,24.5 39.2,23.97 39.2,19.77 v38.91,19.48
  Bottom 0.254: v38.91,19.48 29.81,19.48 28.27,21.02 28.27,24.14 27.94,24.47 v17.22,24.47
RXCAN  (via drill 0.6)
  Top 0.305: IC3.4 42.77,19.53 v41.9,20.43 | v30.07,28.1 30.76,28.1 30.96,28.3 31.7,28.3 IC1.24
  Bottom 0.305: v41.9,20.43 31.4,20.51 29.16,21.72 29.16,28.09 v30.07,28.1
SCK  (via drill 0.6)
  Top 0.254: IC6.6 19.88,35.16 | 19.88,35.16 21.32,35.16 22.99,36.82 22.99,37.72 v23.24,37.85 | IC7.2 16.47,27.14 17.51,28.17 17.51,34.86 17.94,35.29 19.74,35.29 19.88,35.16
  Top 0.305: IC2.8 46.12,46.41 45.73,46.03 45.73,44.77 v44.71,43.8 | v44.46,39.78 41.91,39.78 IC1.14
  Bottom 0.254: v23.24,37.85 31.43,37.97 31.97,38.51 31.97,39.16 32.42,39.61 44.29,39.61 v44.46,39.78
  Bottom 0.305: v44.71,43.8 44.71,40.17 v44.46,39.78
TPIN+  (via drill 0.6)
  Top 0.305: RJ1.RD+ 25.99,52.3 R12.1 | IC2.13 52.47,51.12 51.5,52.09 34.76,52.09 v34.55,52.3
  Bottom 0.305: v34.55,52.3 RJ1.RD+
TPIN-  (via drill 0.6)
  Top 0.305: RJ1.RD- 25.95,48.48 R13.1 | IC2.12 51.2,50.98 50.44,51.47 46.35,51.47 45.48,50.87 45.48,50.51 44.52,49.55 36.19,49.55 35.38,48.74 35.38,48.19 v35.04,47.85
  Bottom 0.305: v35.04,47.85 23.24,47.85 RJ1.RD-
TPOUT+  (via drill 0.6)
  Top 0.305: RJ1.TD+ 20.07,56.39 v20.38,56.7 | v23.77,55.17 26.45,55.11 R9.2 | IC2.17 51.2,59.55 v51.25,59.64
  Bottom 0.305: v20.38,56.7 23.88,56.7 24.6,55.98 24.6,55.21 v23.77,55.17 | v51.25,59.64 51.25,56.41 50.05,55.21 37.29,55.21 35.96,53.88 35.96,51.63 35.09,50.76 24.69,50.76 23.74,49.81 21.71,49.81 21.38,50.14 21.38,50.72 20.92,51.07 19.13,51.07 18.34,51.97 18.34,54.29 18.92,54.87 20.04,54.87 RJ1.TD+
TPOUT-  (via drill 0.6)
  Top 0.305: RJ1.TD- 22.61,57.09 23.41,57.89 26.31,57.89 R10.2 | IC2.16 52.47,59.65 v52.56,59.66
  Bottom 0.305: v52.56,59.66 52.46,59.9 52.1,60.61 43.23,60.61 42.36,59.74 42.36,58.87 41.9,58.41 35.74,58.41 34.71,59.44 27.69,59.44 26.99,58.74 26.99,54.76 26.07,53.84 22.88,53.84 RJ1.TD-
TXCAN  (via drill 0.6)
  Top 0.305: IC3.1 47.28,21.5 v47.07,21.71 | v33.56,23.96 33.62,28.41 32.38,29.65 31.79,29.65 IC1.23
  Bottom 0.305: v47.07,21.71 36.31,21.7 v33.56,23.96
VCC  (via drill 0.6)
  Top 0.203: 49.59,21.59 R11.2 | 44.6,26.67 44.61,26.57
  Top 0.254: IC6.8 IC6.7 17.16,36.42 16.66,35.92 16.66,31.63 15.81,30.78 10.33,30.78 10.13,30.78 | 8.83,34.09 C13.2 | IC7.5 IC7.6 IC7.3 12.13,25.86 10.91,27.09 10.56,27.09
  Top 0.305: C5.1 28.71,32.39 29.44,32.39 30.45,33.4 IC1.20 35.74,33.4 36.12,33.02 | 37.74,17.63 J3.2 | v31.02,9.01 31.02,8.96 | 37.64,15.87 38.39,15.56 40.48,15.56 40.84,15.55 41.69,15.55 43.57,17.5 44.09,17.5 44.73,18.14 IC3.3 44.7,20.32 45.78,21.59 45.78,25.4 | 58.29,5.87 L1.2 | R2.2 44.6,26.67 44.6,27.28 v43.64,28.24 43.64,28.14 | R6.1 47.33,40.65 47.34,40.87 | R7.1 52,41.25 51.39,40.85 | v38.35,28.29 36.41,28.29 36.11,27.99 | L2.2 21.02,59.85 19.15,60.68 12.27,60.68 11.18,58.68 11.18,54.18 9.28,52.28 2.29,52.28 1.26,53.31 | R14.2 10.22,26.67 6.41,26.67 C16.2 | 54.67,55.88 54.67,55.63
  Top 0.406: 63.11,4.95 C2.+ | 44.61,26.57 45.78,25.4 49.59,21.59
  Top 0.61: 36.1,21.04 36.87,20.03 36.96,19.96 37.74,19.18 37.74,17.63 | 31.02,8.96 IC4.4 | C3.2 37.59,13.65 37.69,14.12 37.64,15.87 J3.2 | v55.91,5.87 58.29,5.87 | 36.11,21.01 36.11,27.99 36.12,33.02 36.12,40.84 47.34,40.87 51.39,40.85 52.13,40.64 53.4,39.37 R4.2 | IC2.28 37.23,56.16 36.29,55.23 | 36.29,55.23 36.27,55.21 36.21,55.21 36.29,55.23 | 32.38,54.55 32.38,53.33 C9.2 | IC2.25 41.04,55.78 40.3,55.24 | IC2.20 47.39,55.56 46.91,55.22 46.64,55.22 46.4,55.23 46.49,55.21 | IC2.19 48.66,55.74 48.3,55.28 | IC2.15 53.73,55.62 | IC5.2 67.32,49.74 68.11,50.53 68.11,55.23 67.79,55.55 63.42,55.55 62.98,55.11 | 62.98,55.11 62.78,54.91 62.78,54.27 C23.1 62.92,54.13 R19.1 | 62.48,55.62 62.98,55.11 | C13.2 1.81,34.27 1.26,34.82
  Top 0.813: L1.2 63.11,4.95 | 36.21,55.21 33.04,55.21 32.38,54.55 | 36.29,55.23 40.3,55.24 46.4,55.23 | 48.3,55.28 46.49,55.21 | 46.91,55.22 53.27,55.22 53.73,55.62 54.67,55.63 62.48,55.62 | C9.2 32.36,55.85 31.13,57.08 31.13,62.7 29.69,64.14 3.23,64.14 1.26,62.17 1.26,53.31 1.26,34.82 1.26,28 | 1.26,28 1.18,2.84 v1.96,1.2 | 10.56,27.09 10.56,30.55 10.33,30.78 | 1.26,28 2.24,27.02 C16.2 6.59,27.28 6.59,29.68 7.69,30.78 10.13,30.78 | 54.67,55.88 58.48,52.07 58.48,43.18 52.13,43.18 R7.1
  Bottom 0.305: v43.64,28.24 39.1,28.24 v38.35,28.29
  Bottom 0.61: v31.02,9.01 32.2,9.09 36.77,9.06 40.02,5.87 v55.91,5.87 | v1.96,1.2 2.31,1.2 2.51,1
  Bottom 0.813: v31.02,9.01 30.98,8.25 30.98,2.2 30.06,1 2.51,1 2.36,1 v1.96,1.2
VIN2
  Top 0.406: 34.41,3.36 C1.+
  Top 0.813: IC4.1 33.59,3.44 | 33.59,3.44 34.41,3.36 | D1.C 66.78,31.86 67.31,31.33 67.31,28.78 67.56,28.53 69.19,28.53 70.76,27.13 70.76,2.39 69.69,1.49 35.54,1.49 33.59,3.44

### Text on the board
tNames: Frankfurt Ethernet | rev A | www.grodansparadis.com | INIT | POWER | CONNECTED | BUS WARN | BUS OFF